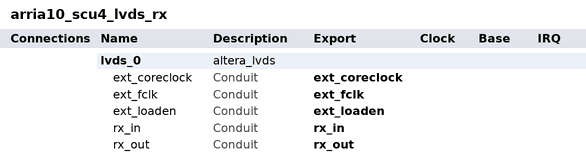
[diagram p0: system contents]
# Platform Designer (Qsys) system arria10_scu4_lvds_rx, Arria 10 10AX027E3F29E2SG
# Parameters at their usual value, and those the tool derives, are not listed.
package require -exact qsys 23.1
create_system arria10_scu4_lvds_rx
set_project_property DEVICE_FAMILY {Arria 10}
set_project_property DEVICE 10AX027E3F29E2SG

add_instance lvds_0 altera_lvds 23.1
set_instance_property lvds_0 AUTO_EXPORT true
set_instance_parameter_value lvds_0 CPA_ENABLED false
set_instance_parameter_value lvds_0 DATA_RATE 1000.0
set_instance_parameter_value lvds_0 ENABLE_DIV_RECONFIG false
set_instance_parameter_value lvds_0 ENABLE_MIGRATABLE_PORT_MAPPINGS false
set_instance_parameter_value lvds_0 GENERATE_SDC_FILE true
set_instance_parameter_value lvds_0 INCLOCK_FREQUENCY 125.0
set_instance_parameter_value lvds_0 J_FACTOR 8
set_instance_parameter_value lvds_0 MODE RX_Non-DPA
set_instance_parameter_value lvds_0 NUM_CHANNELS 1
set_instance_parameter_value lvds_0 PLL_CORECLOCK_RESOURCE Periphery
set_instance_parameter_value lvds_0 PLL_USE_RESET false
set_instance_parameter_value lvds_0 RX_BITSLIP_ASSERT_MAX false
set_instance_parameter_value lvds_0 RX_BITSLIP_USE_RESET false
set_instance_parameter_value lvds_0 RX_CDR_SIMULATION_PPM_DRIFT 0
set_instance_parameter_value lvds_0 RX_DPA_ALIGN_TO_RISING_EDGE_ONLY false
set_instance_parameter_value lvds_0 RX_DPA_LOSE_LOCK_ON_ONE_CHANGE false
set_instance_parameter_value lvds_0 RX_DPA_USE_HOLD false
set_instance_parameter_value lvds_0 RX_DPA_USE_RESET false
set_instance_parameter_value lvds_0 RX_FIFO_USE_RESET false
set_instance_parameter_value lvds_0 RX_INCLOCK_PHASE_SHIFT 0
set_instance_parameter_value lvds_0 RX_RCCS_VAL 0.0
set_instance_parameter_value lvds_0 RX_USE_BITSLIP false
set_instance_parameter_value lvds_0 TX_EXPORT_CORECLOCK true
set_instance_parameter_value lvds_0 TX_OUTCLOCK_DIVISION 2
set_instance_parameter_value lvds_0 TX_OUTCLOCK_PHASE_SHIFT 0
set_instance_parameter_value lvds_0 TX_REGISTER_CLOCK tx_coreclock
set_instance_parameter_value lvds_0 TX_USE_OUTCLOCK false
set_instance_parameter_value lvds_0 USE_CLOCK_PIN false
set_instance_parameter_value lvds_0 USE_EXTERNAL_PLL true
set_instance_parameter_value lvds_0 gui_actual_outclk_duty_cycle_5 50.0
set_instance_parameter_value lvds_0 gui_actual_outclk_duty_cycle_6 50.0
set_instance_parameter_value lvds_0 gui_actual_outclk_duty_cycle_7 50.0
set_instance_parameter_value lvds_0 gui_actual_outclk_duty_cycle_8 50.0
set_instance_parameter_value lvds_0 gui_actual_outclk_frequency_5 100.0
set_instance_parameter_value lvds_0 gui_actual_outclk_frequency_6 100.0
set_instance_parameter_value lvds_0 gui_actual_outclk_frequency_7 100.0
set_instance_parameter_value lvds_0 gui_actual_outclk_frequency_8 100.0
set_instance_parameter_value lvds_0 gui_desired_outclk_duty_cycle_5 50.0
set_instance_parameter_value lvds_0 gui_desired_outclk_duty_cycle_6 50.0
set_instance_parameter_value lvds_0 gui_desired_outclk_duty_cycle_7 50.0
set_instance_parameter_value lvds_0 gui_desired_outclk_duty_cycle_8 50.0
set_instance_parameter_value lvds_0 gui_desired_outclk_frequency_5 100.0
set_instance_parameter_value lvds_0 gui_desired_outclk_frequency_6 100.0
set_instance_parameter_value lvds_0 gui_desired_outclk_frequency_7 100.0
set_instance_parameter_value lvds_0 gui_desired_outclk_frequency_8 100.0
set_instance_parameter_value lvds_0 gui_enable_advanced_mode 0
set_instance_parameter_value lvds_0 gui_number_of_pll_output_clocks 0
set_instance_parameter_value lvds_0 gui_outclk_actual_phase_shift_deg_5 0.0
set_instance_parameter_value lvds_0 gui_outclk_actual_phase_shift_deg_6 0.0
set_instance_parameter_value lvds_0 gui_outclk_actual_phase_shift_deg_7 0.0
set_instance_parameter_value lvds_0 gui_outclk_actual_phase_shift_deg_8 0.0
set_instance_parameter_value lvds_0 gui_outclk_actual_phase_shift_ps_5 0.0
set_instance_parameter_value lvds_0 gui_outclk_actual_phase_shift_ps_6 0.0
set_instance_parameter_value lvds_0 gui_outclk_actual_phase_shift_ps_7 0.0
set_instance_parameter_value lvds_0 gui_outclk_actual_phase_shift_ps_8 0.0
set_instance_parameter_value lvds_0 gui_outclk_desired_phase_shift_5 0.0
set_instance_parameter_value lvds_0 gui_outclk_desired_phase_shift_6 0.0
set_instance_parameter_value lvds_0 gui_outclk_desired_phase_shift_7 0.0
set_instance_parameter_value lvds_0 gui_outclk_desired_phase_shift_8 0.0
set_instance_parameter_value lvds_0 gui_outclk_phase_shift_unit_0 0
set_instance_parameter_value lvds_0 gui_outclk_phase_shift_unit_1 0
set_instance_parameter_value lvds_0 gui_outclk_phase_shift_unit_2 0
set_instance_parameter_value lvds_0 gui_outclk_phase_shift_unit_3 0
set_instance_parameter_value lvds_0 gui_outclk_phase_shift_unit_4 0
set_instance_parameter_value lvds_0 gui_outclk_phase_shift_unit_5 0
set_instance_parameter_value lvds_0 gui_outclk_phase_shift_unit_6 0
set_instance_parameter_value lvds_0 gui_outclk_phase_shift_unit_7 0
set_instance_parameter_value lvds_0 gui_outclk_phase_shift_unit_8 0

# exported interfaces
add_interface ext_coreclock conduit end
set_interface_property ext_coreclock EXPORT_OF lvds_0.ext_coreclock
add_interface ext_fclk conduit end
set_interface_property ext_fclk EXPORT_OF lvds_0.ext_fclk
add_interface ext_loaden conduit end
set_interface_property ext_loaden EXPORT_OF lvds_0.ext_loaden
add_interface rx_in conduit end
set_interface_property rx_in EXPORT_OF lvds_0.rx_in
add_interface rx_out conduit end
set_interface_property rx_out EXPORT_OF lvds_0.rx_out

set_interconnect_requirement {$system} qsys_mm.clockCrossingAdapter HANDSHAKE
set_interconnect_requirement {$system} qsys_mm.enableEccProtection FALSE
set_interconnect_requirement {$system} qsys_mm.insertDefaultSlave FALSE
set_interconnect_requirement {$system} qsys_mm.maxAdditionalLatency 1

save_system arria10_scu4_lvds_rx.qsys
